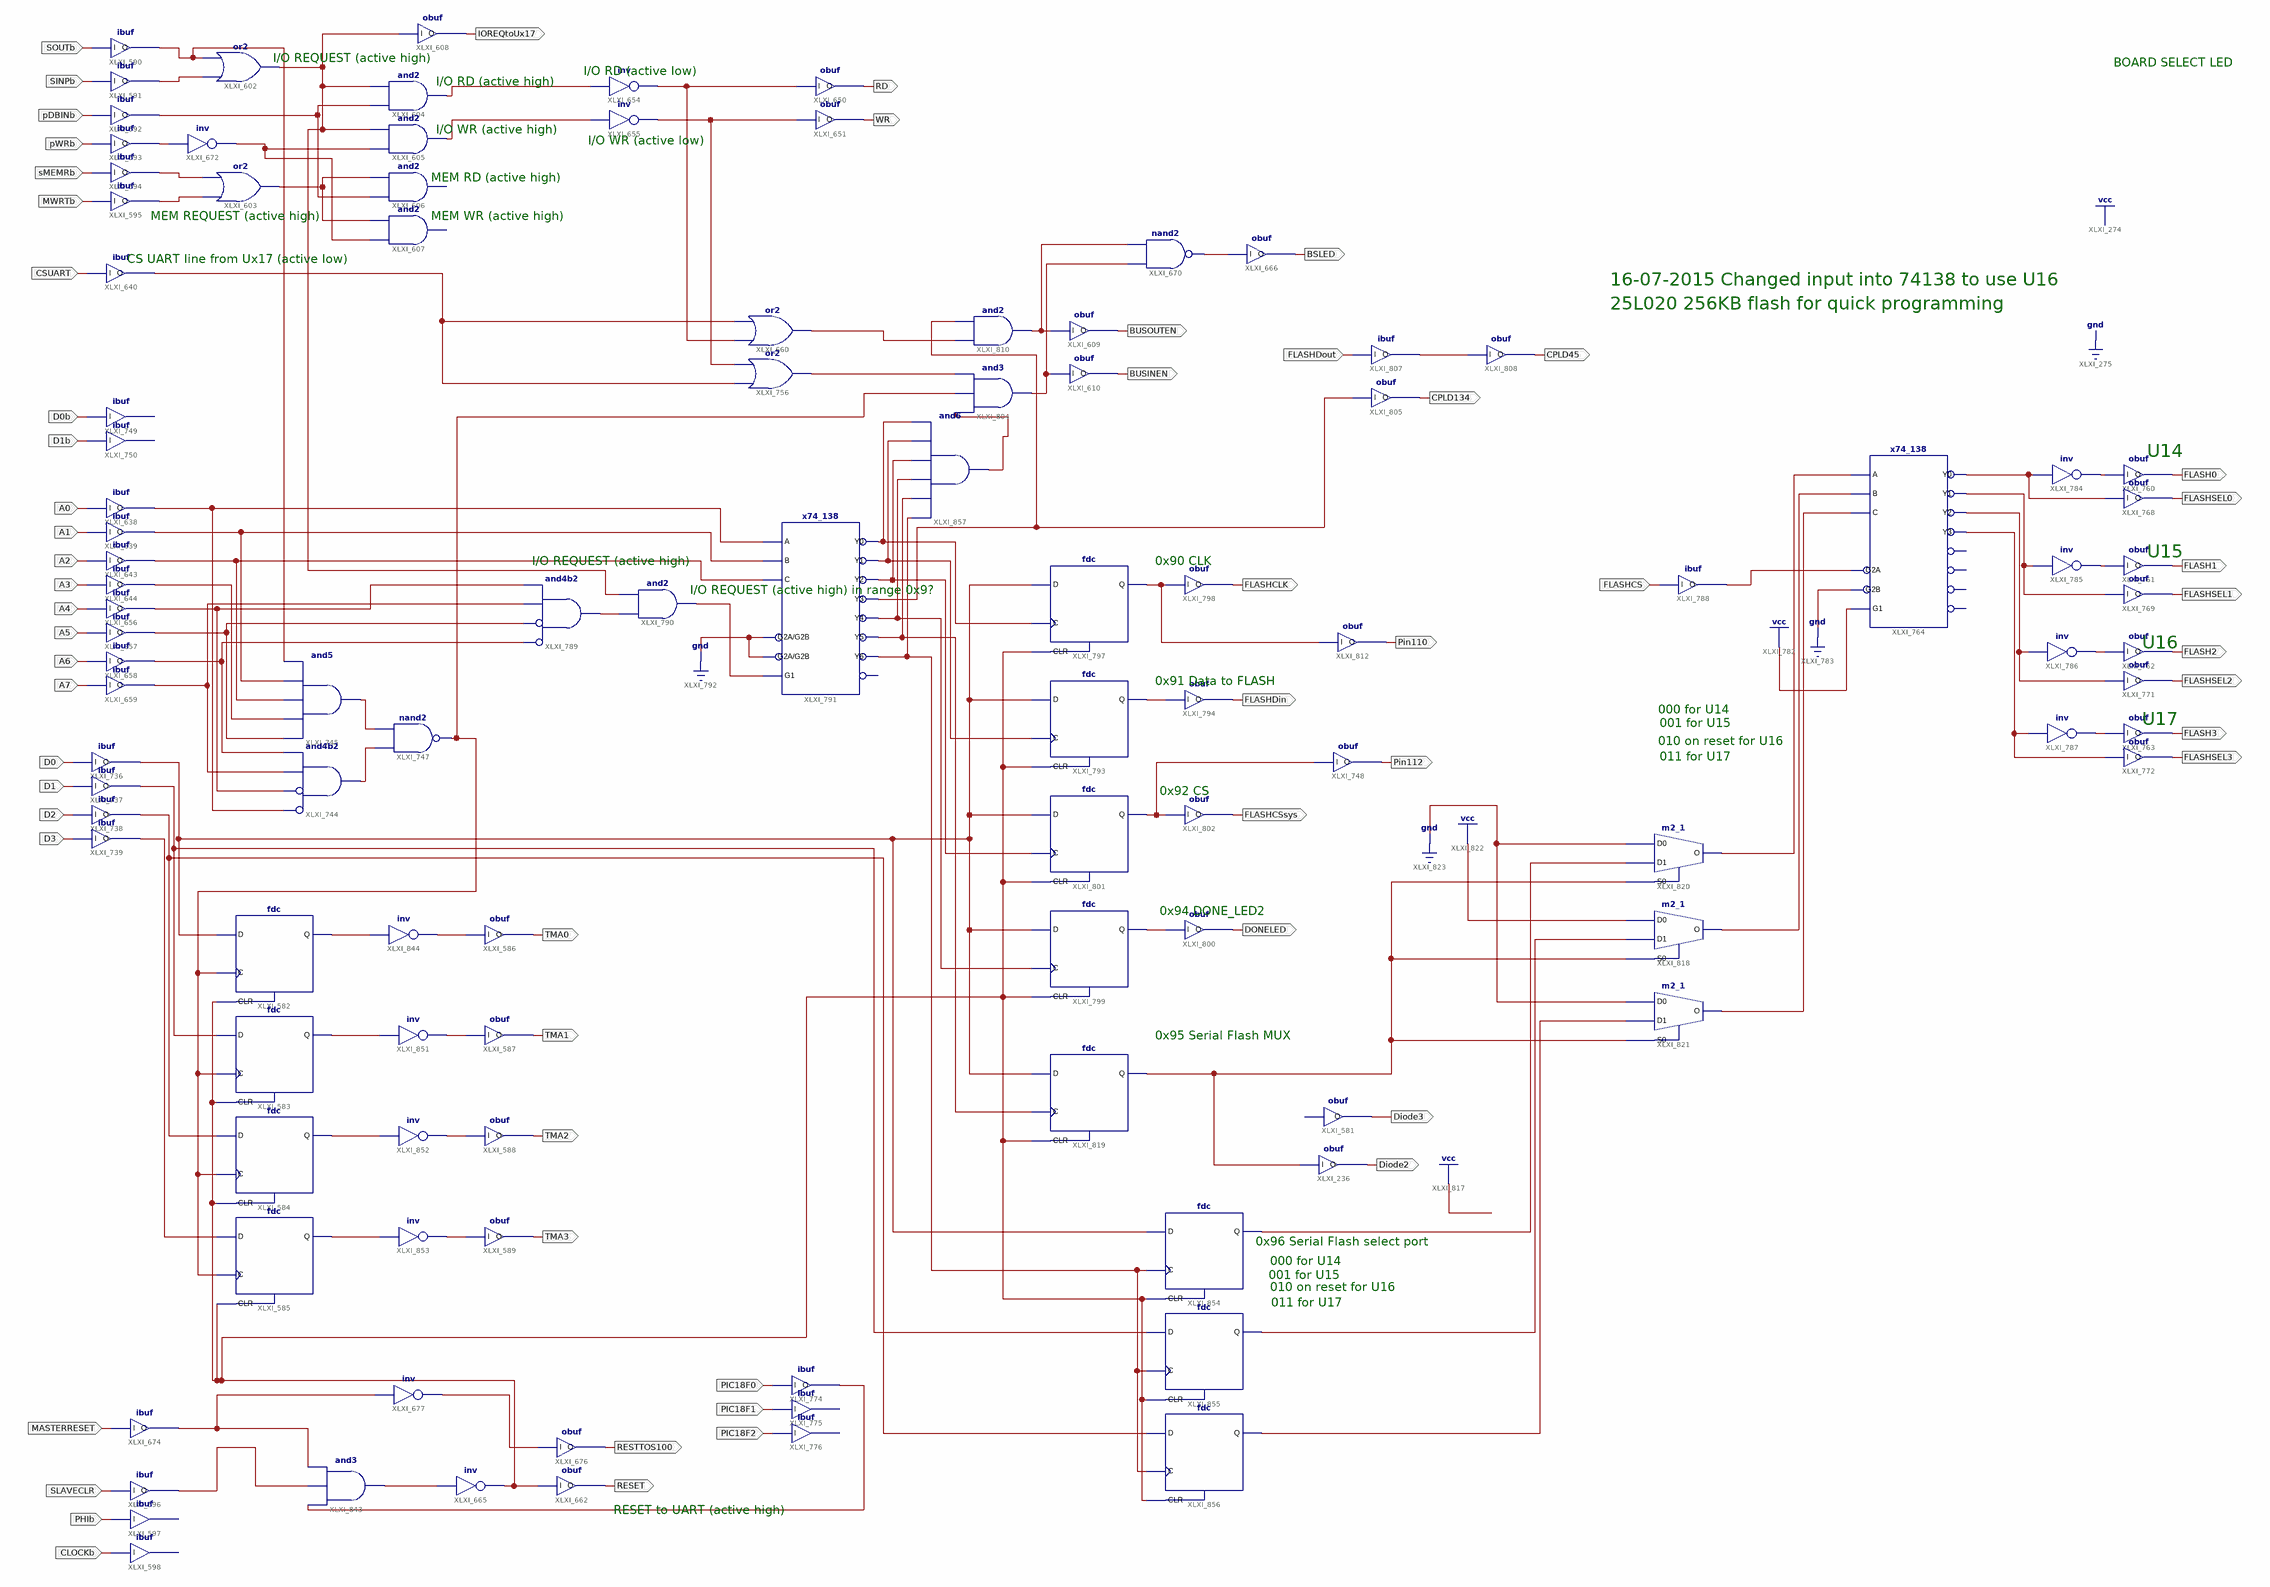
[diagram p0: schematic sheet 1]
// Xilinx ISE schematic U20v2.sch (xc9500xl) as structural Verilog: 108 symbols, 60 ports
module U20v2 (
  input  SOUTb,
  input  SINPb,
  input  pDBINb,
  input  pWRb,
  input  sMEMRb,
  input  MWRTb,
  input  CSUART,
  input  A0,
  input  A1,
  input  A2,
  input  A3,
  input  A4,
  input  A5,
  input  A6,
  input  A7,
  input  SLAVECLR,
  input  PHIb,
  input  CLOCKb,
  input  MASTERRESET,
  input  D0,
  input  D1,
  input  D2,
  input  D3,
  input  D0b,
  input  D1b,
  input  FLASHCS,
  input  FLASHDout,
  input  PIC18F0,
  input  PIC18F1,
  input  PIC18F2,
  output IOREQtoUx17,
  output RD,
  output WR,
  output RESET,
  output RESTTOS100,
  output BSLED,
  output BUSOUTEN,
  output BUSINEN,
  output FLASH0,
  output FLASH3,
  output FLASH2,
  output FLASH1,
  output FLASHSEL1,
  output FLASHSEL2,
  output FLASHSEL3,
  output FLASHSEL0,
  output FLASHDin,
  output FLASHCLK,
  output DONELED,
  output FLASHCSsys,
  output CPLD45,
  output CPLD134,
  output Pin112,
  output Pin110,
  output Diode3,
  output Diode2,
  output TMA0,
  output TMA1,
  output TMA2,
  output TMA3
);

  wire XLXN_809, XLXN_811, XLXN_814, XLXN_816, XLXN_817, XLXN_819, XLXN_859, XLXN_867, XLXN_869, XLXN_870,
       XLXN_882, XLXN_883, XLXN_884, XLXN_886, XLXN_903, XLXN_909, XLXN_910, XLXN_976, XLXN_977, XLXN_978,
       XLXN_979, XLXN_980, XLXN_984, XLXN_985, XLXN_986, XLXN_987, XLXN_988, XLXN_989, XLXN_996, XLXN_1011,
       XLXN_1014, XLXN_1033, XLXN_1035, XLXN_1039, XLXN_1041, XLXN_1060, XLXN_1061, XLXN_1062, XLXN_1063,
       XLXN_1066, XLXN_1068, XLXN_1069, XLXN_1070, XLXN_1071, XLXN_1072, XLXN_1076, XLXN_1082, XLXN_1092,
       XLXN_1101, XLXN_1108, XLXN_1109, XLXN_1111, XLXN_1113, XLXN_1131, XLXN_1132, XLXN_1133, XLXN_1147,
       XLXN_1162, XLXN_1163, XLXN_1165, XLXN_1171, XLXN_1172, XLXN_1173, XLXN_1174, XLXN_1175, XLXN_1176,
       XLXN_1177, XLXN_1178, XLXN_1185, XLXN_1186, XLXN_1187, XLXN_1188, XLXN_1189, XLXN_1190, XLXN_1192,
       XLXN_1193, XLXN_1198, XLXN_1200, XLXN_1201;

  ibuf XLXI_590 (.I(SOUTb), .O(XLXN_996));
  ibuf XLXI_591 (.I(SINPb), .O(XLXN_809));
  ibuf XLXI_592 (.I(pDBINb), .O(XLXN_1165));
  ibuf XLXI_593 (.I(pWRb), .O(XLXN_886));
  ibuf XLXI_594 (.I(sMEMRb), .O(XLXN_816));
  ibuf XLXI_595 (.I(MWRTb), .O(XLXN_817));
  or XLXI_602 (XLXN_819, XLXN_809, XLXN_996);
  or XLXI_603 (XLXN_814, XLXN_817, XLXN_816);
  and XLXI_604 (XLXN_859, XLXN_1165, XLXN_819);
  and XLXI_605 (XLXN_987, XLXN_811, XLXN_819);
  // and2 XLXI_606 has open pins: I0=XLXN_1165, I1=XLXN_814, O=open
  // and2 XLXI_607 has open pins: I0=XLXN_811, I1=XLXN_814, O=open
  obuf XLXI_608 (.I(XLXN_819), .O(IOREQtoUx17));
  ibuf XLXI_640 (.I(CSUART), .O(XLXN_867));
  obuf XLXI_650 (.I(XLXN_869), .O(RD));
  obuf XLXI_651 (.I(XLXN_870), .O(WR));
  not XLXI_654 (XLXN_869, XLXN_859);
  not XLXI_655 (XLXN_870, XLXN_987);
  or XLXI_660 (XLXN_1108, XLXN_869, XLXN_867);
  not XLXI_672 (XLXN_811, XLXN_886);
  ibuf XLXI_638 (.I(A0), .O(XLXN_980));
  ibuf XLXI_639 (.I(A1), .O(XLXN_986));
  ibuf XLXI_643 (.I(A2), .O(XLXN_985));
  ibuf XLXI_644 (.I(A3), .O(XLXN_984));
  ibuf XLXI_656 (.I(A4), .O(XLXN_979));
  ibuf XLXI_657 (.I(A5), .O(XLXN_1070));
  ibuf XLXI_658 (.I(A6), .O(XLXN_1069));
  ibuf XLXI_659 (.I(A7), .O(XLXN_1071));
  ibuf XLXI_596 (.I(SLAVECLR), .O(XLXN_1162));
  ibuf XLXI_597 (.I(PHIb));  // open: O
  ibuf XLXI_598 (.I(CLOCKb));  // open: O
  obuf XLXI_662 (.I(XLXN_1092), .O(RESET));
  not XLXI_665 (XLXN_1092, XLXN_903);
  ibuf XLXI_674 (.I(MASTERRESET), .O(XLXN_910));
  obuf XLXI_676 (.I(XLXN_909), .O(RESTTOS100));
  not XLXI_677 (XLXN_909, XLXN_910);
  fdc XLXI_582 (.C(XLXN_1014), .CLR(XLXN_1092), .D(XLXN_1193), .Q(XLXN_1171));
  fdc XLXI_583 (.C(XLXN_1014), .CLR(XLXN_1092), .D(XLXN_976), .Q(XLXN_1172));
  fdc XLXI_584 (.C(XLXN_1014), .CLR(XLXN_1092), .D(XLXN_977), .Q(XLXN_1173));
  fdc XLXI_585 (.C(XLXN_1014), .CLR(XLXN_1092), .D(XLXN_978), .Q(XLXN_1174));
  ibuf XLXI_736 (.I(D0), .O(XLXN_1193));
  ibuf XLXI_737 (.I(D1), .O(XLXN_976));
  ibuf XLXI_738 (.I(D2), .O(XLXN_977));
  ibuf XLXI_739 (.I(D3), .O(XLXN_978));
  and XLXI_744 (XLXN_989, ~XLXN_980, ~XLXN_979, XLXN_1071, XLXN_1069);  // and4b2
  and XLXI_745 (XLXN_988, XLXN_1070, XLXN_984, XLXN_985, XLXN_986, XLXN_996);
  nand XLXI_747 (XLXN_1014, XLXN_989, XLXN_988);
  ibuf XLXI_749 (.I(D0b));  // open: O
  ibuf XLXI_750 (.I(D1b));  // open: O
  obuf XLXI_610 (.I(XLXN_884), .O(BUSINEN));
  obuf XLXI_609 (.I(XLXN_883), .O(BUSOUTEN));
  obuf XLXI_666 (.I(XLXN_882), .O(BSLED));
  nand XLXI_670 (XLXN_882, XLXN_884, XLXN_883);
  or XLXI_756 (XLXN_1011, XLXN_867, XLXN_870);
  obuf XLXI_760 (.I(XLXN_1060), .O(FLASH0));
  x74_138 XLXI_764 (
    .A(XLXN_1131), .B(XLXN_1132), .C(XLXN_1133), .G1(1'b1), .G2A(XLXN_1066), .G2B(1'b0), .Y0(XLXN_1033),
    .Y1(XLXN_1035), .Y2(XLXN_1039), .Y3(XLXN_1041));  // open: Y4, Y5, Y6, Y7
  obuf XLXI_763 (.I(XLXN_1063), .O(FLASH3));
  obuf XLXI_762 (.I(XLXN_1062), .O(FLASH2));
  obuf XLXI_761 (.I(XLXN_1061), .O(FLASH1));
  obuf XLXI_769 (.I(XLXN_1035), .O(FLASHSEL1));
  obuf XLXI_771 (.I(XLXN_1039), .O(FLASHSEL2));
  obuf XLXI_772 (.I(XLXN_1041), .O(FLASHSEL3));
  obuf XLXI_768 (.I(XLXN_1033), .O(FLASHSEL0));
  not XLXI_784 (XLXN_1060, XLXN_1033);
  not XLXI_785 (XLXN_1061, XLXN_1035);
  not XLXI_786 (XLXN_1062, XLXN_1039);
  not XLXI_787 (XLXN_1063, XLXN_1041);
  ibuf XLXI_788 (.I(FLASHCS), .O(XLXN_1066));
  and XLXI_789 (XLXN_1068, ~XLXN_1069, ~XLXN_1070, XLXN_1071, XLXN_979);  // and4b2
  and XLXI_790 (XLXN_1072, XLXN_1068, XLXN_819);
  x74_138 XLXI_791 (
    .A(XLXN_980), .B(XLXN_986), .C(XLXN_985), .G1(XLXN_1072), .G2A(1'b0), .G2B(1'b0), .Y0(XLXN_1185),
    .Y1(XLXN_1186), .Y2(XLXN_1187), .Y3(XLXN_1109), .Y4(XLXN_1188), .Y5(XLXN_1189), .Y6(XLXN_1190));  // open: Y7
  fdc XLXI_793 (.C(XLXN_1186), .CLR(XLXN_1092), .D(XLXN_1193), .Q(XLXN_1076));
  obuf XLXI_794 (.I(XLXN_1076), .O(FLASHDin));
  fdc XLXI_797 (.C(XLXN_1185), .CLR(XLXN_1092), .D(XLXN_1193), .Q(XLXN_1113));
  obuf XLXI_798 (.I(XLXN_1113), .O(FLASHCLK));
  fdc XLXI_799 (.C(XLXN_1188), .CLR(XLXN_1092), .D(XLXN_1193), .Q(XLXN_1082));
  obuf XLXI_800 (.I(XLXN_1082), .O(DONELED));
  fdc XLXI_801 (.C(XLXN_1187), .CLR(XLXN_1092), .D(XLXN_1193), .Q(XLXN_1111));
  obuf XLXI_802 (.I(XLXN_1111), .O(FLASHCSsys));
  and XLXI_804 (XLXN_884, XLXN_1192, XLXN_1014, XLXN_1011);
  ibuf XLXI_807 (.I(FLASHDout), .O(XLXN_1101));
  obuf XLXI_808 (.I(XLXN_1101), .O(CPLD45));
  obuf XLXI_805 (.I(XLXN_1109), .O(CPLD134));
  and XLXI_810 (XLXN_883, XLXN_1108, XLXN_1109);
  obuf XLXI_748 (.I(XLXN_1111), .O(Pin112));
  obuf XLXI_812 (.I(XLXN_1113), .O(Pin110));
  m2_1 XLXI_818 (.D0(1'b1), .D1(XLXN_1201), .S0(XLXN_1147), .O(XLXN_1132));
  fdc XLXI_819 (.C(XLXN_1189), .CLR(XLXN_1092), .D(XLXN_1193), .Q(XLXN_1147));
  m2_1 XLXI_820 (.D0(1'b0), .D1(XLXN_1200), .S0(XLXN_1147), .O(XLXN_1131));
  m2_1 XLXI_821 (.D0(1'b0), .D1(XLXN_1198), .S0(XLXN_1147), .O(XLXN_1133));
  obuf XLXI_581 (.O(Diode3));  // open: I
  obuf XLXI_236 (.I(XLXN_1147), .O(Diode2));
  and XLXI_843 (XLXN_903, XLXN_1163, XLXN_1162, XLXN_910);
  not XLXI_844 (XLXN_1178, XLXN_1171);
  obuf XLXI_586 (.I(XLXN_1178), .O(TMA0));
  obuf XLXI_587 (.I(XLXN_1177), .O(TMA1));
  obuf XLXI_588 (.I(XLXN_1176), .O(TMA2));
  obuf XLXI_589 (.I(XLXN_1175), .O(TMA3));
  not XLXI_851 (XLXN_1177, XLXN_1172);
  not XLXI_852 (XLXN_1176, XLXN_1173);
  not XLXI_853 (XLXN_1175, XLXN_1174);
  fdc XLXI_854 (.C(XLXN_1190), .CLR(XLXN_1092), .D(XLXN_1193), .Q(XLXN_1200));
  fdc XLXI_855 (.C(XLXN_1190), .CLR(XLXN_1092), .D(XLXN_976), .Q(XLXN_1201));
  fdc XLXI_856 (.C(XLXN_1190), .CLR(XLXN_1092), .D(XLXN_977), .Q(XLXN_1198));
  and XLXI_857 (XLXN_1192, XLXN_1190, XLXN_1189, XLXN_1188, XLXN_1187, XLXN_1186, XLXN_1185);
  ibuf XLXI_774 (.I(PIC18F0), .O(XLXN_1163));
  ibuf XLXI_775 (.I(PIC18F1));  // open: O
  ibuf XLXI_776 (.I(PIC18F2));  // open: O

  // Notes on the sheet:
  //   I/O REQUEST (active high)
  //   BOARD SELECT LED
  //   I/O RD (active low)
  //   I/O RD (active high)
  //   I/O WR (active high)
  //   I/O WR (active low)
  //   MEM RD (active high)
  //   MEM REQUEST (active high)
  //   MEM WR (active high)
  //   CS UART line from Ux17 (active low)
  //   16-07-2015 Changed input into 74138 to use U16
  //   25L020 256KB flash for quick programming
  //   U14
  //   U15
  //   I/O REQUEST (active high)
  //   0x90 CLK
  //   I/O REQUEST (active high) in range 0x9?
  //   U16
  //   0x91 Data to FLASH
  //   000 for U14
  //   U17
  //   001 for U15
  //   010 on reset for U16
  //   011 for U17
  //   0x92 CS
  //   0x94 DONE_LED2
  //   0x95 Serial Flash MUX
  //   0x96 Serial Flash select port
  //   000 for U14
  //   001 for U15
  //   010 on reset for U16
  //   011 for U17
  //   RESET to UART (active high)
endmodule
